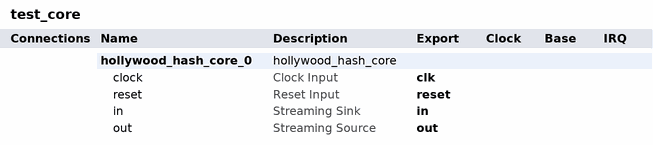
[diagram p0: system contents]
# Platform Designer (Qsys) system test_core, Cyclone V 5CEBA2F17A7
# Parameters at their usual value, and those the tool derives, are not listed.
package require qsys
create_system test_core
set_project_property DEVICE_FAMILY {Cyclone V}
set_project_property DEVICE 5CEBA2F17A7

add_instance hollywood_hash_core_0 hollywood_hash_core 1.0
set_instance_parameter_value hollywood_hash_core_0 R4 65201
set_instance_parameter_value hollywood_hash_core_0 R6 37528

# exported interfaces
add_interface clk clock sink
set_interface_property clk EXPORT_OF hollywood_hash_core_0.clock
add_interface in avalon_streaming sink
set_interface_property in EXPORT_OF hollywood_hash_core_0.in
add_interface out avalon_streaming source
set_interface_property out EXPORT_OF hollywood_hash_core_0.out
add_interface reset reset sink
set_interface_property reset EXPORT_OF hollywood_hash_core_0.reset

set_interconnect_requirement {$system} qsys_mm.clockCrossingAdapter HANDSHAKE
set_interconnect_requirement {$system} qsys_mm.enableEccProtection FALSE
set_interconnect_requirement {$system} qsys_mm.insertDefaultSlave FALSE
set_interconnect_requirement {$system} qsys_mm.maxAdditionalLatency 1

save_system test_core.qsys
